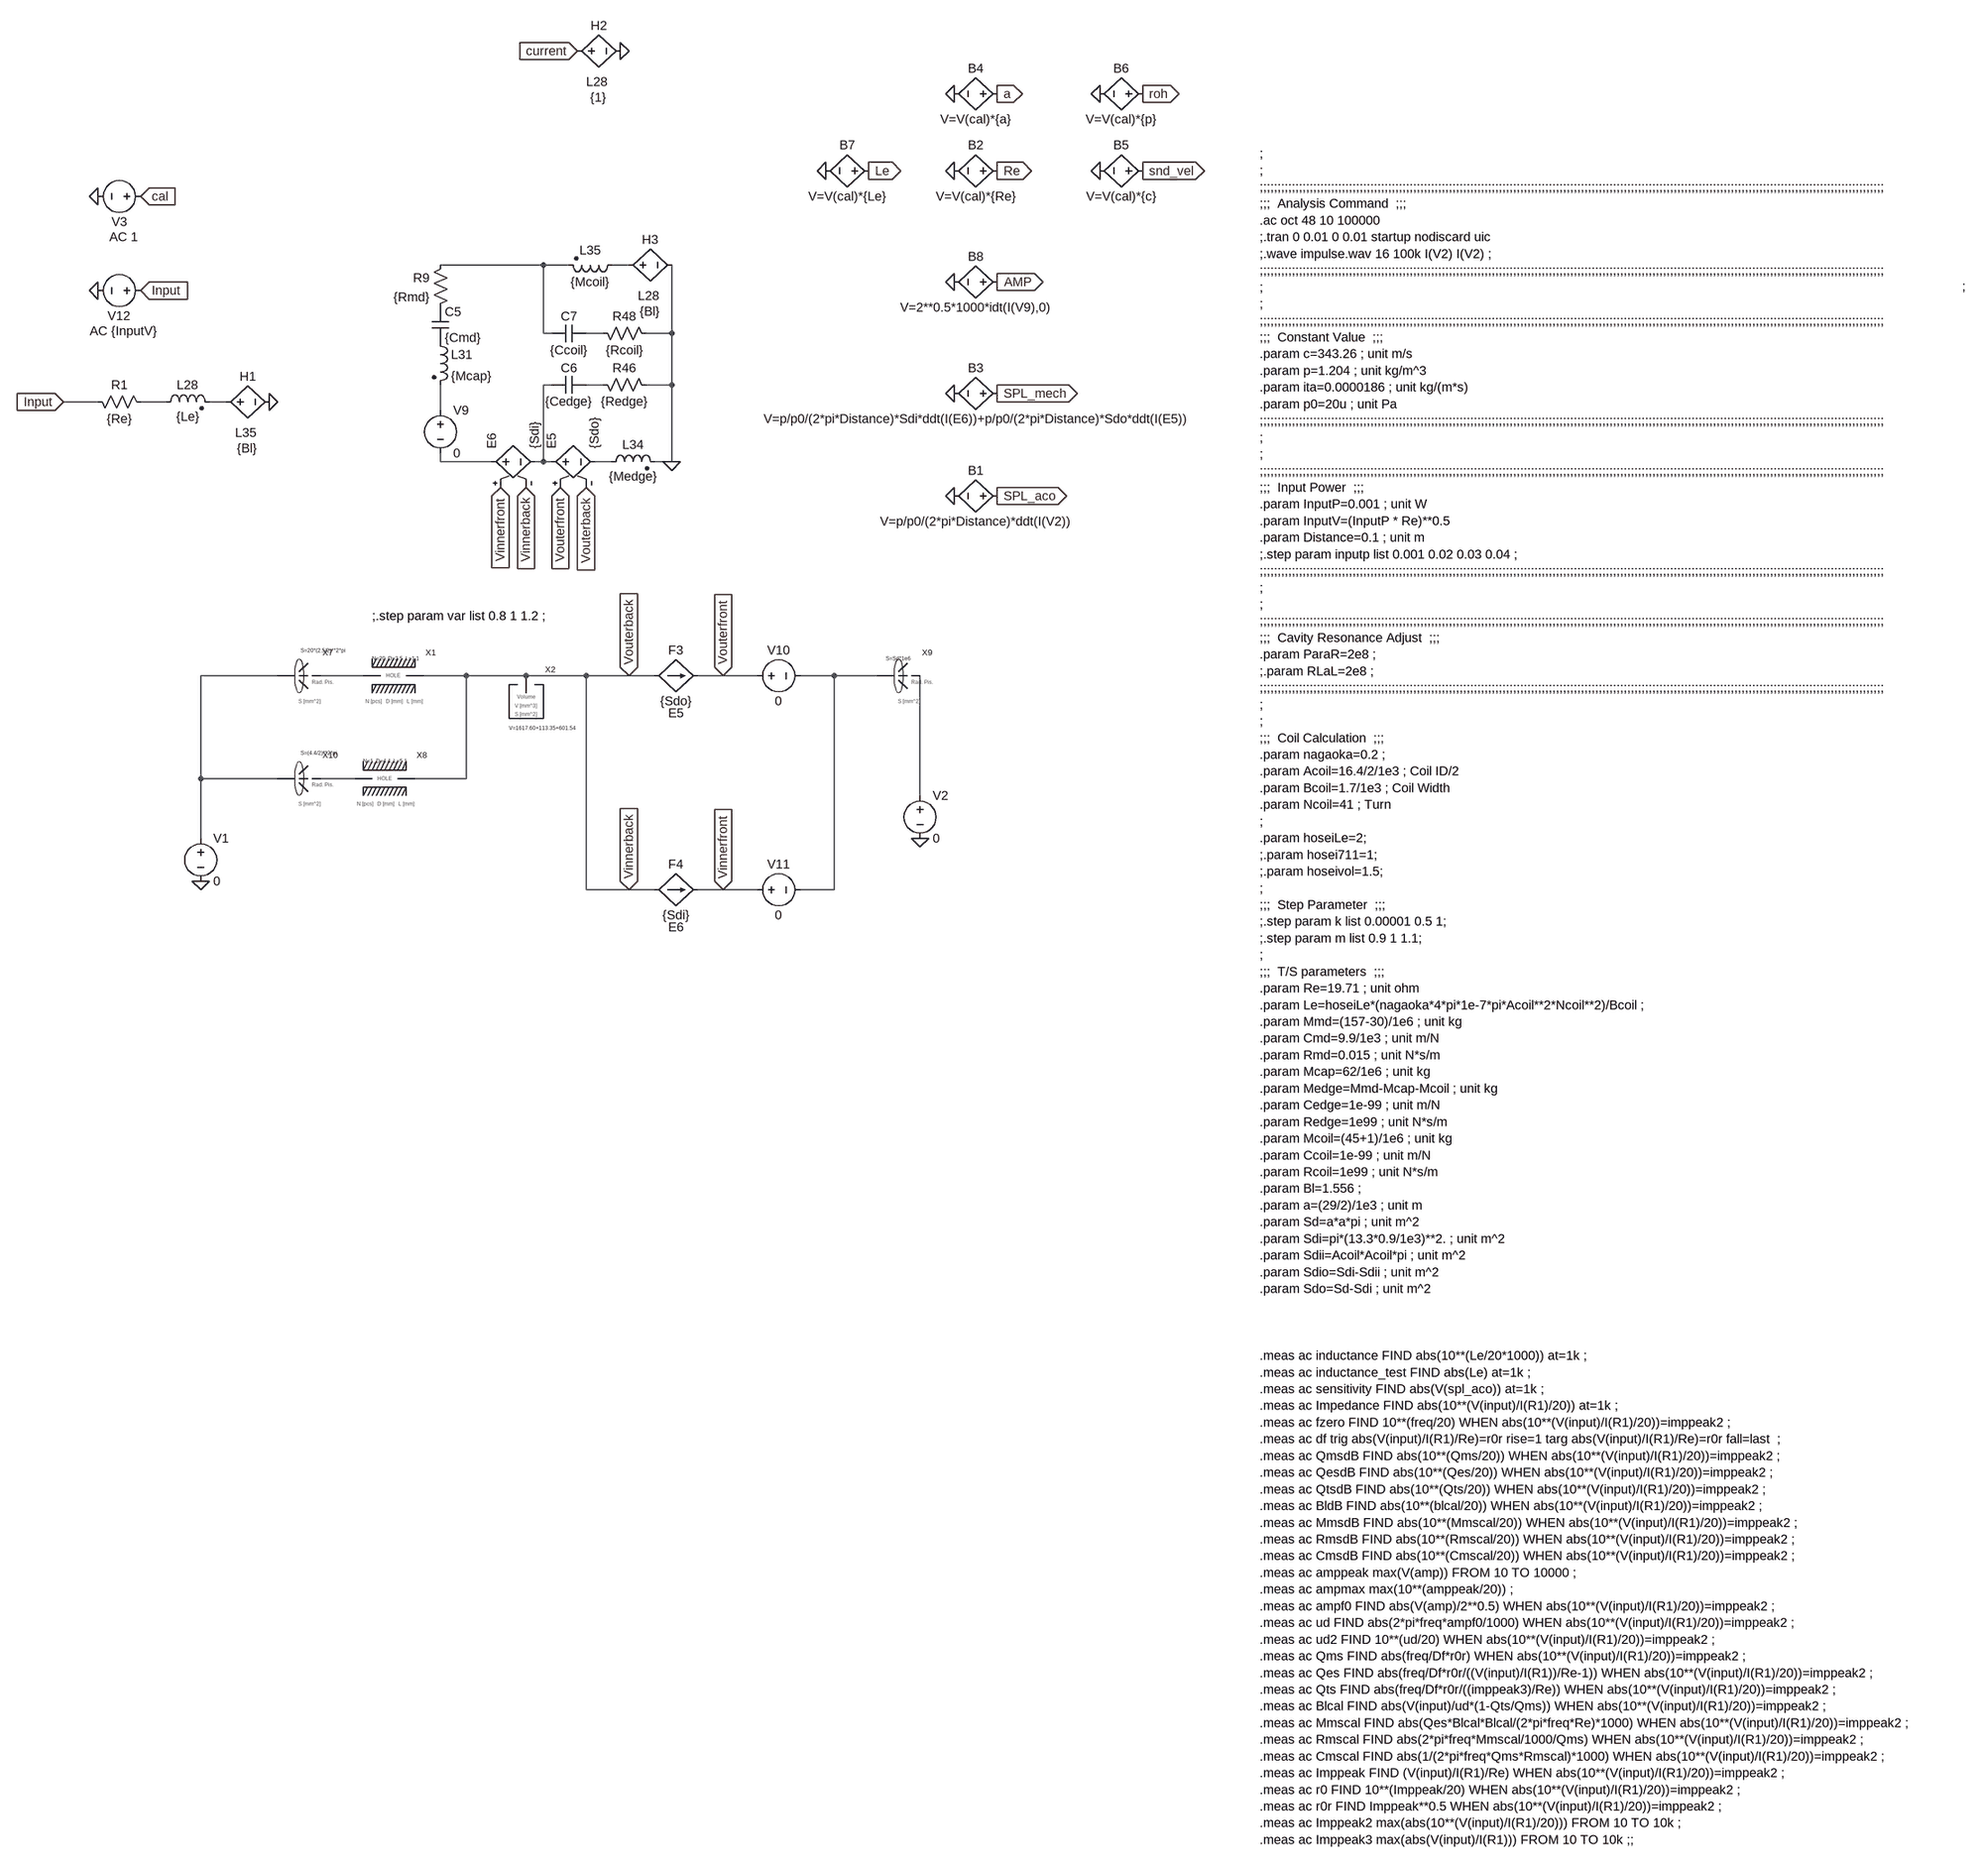
[diagram p0: schematic demo_08_test.asc]
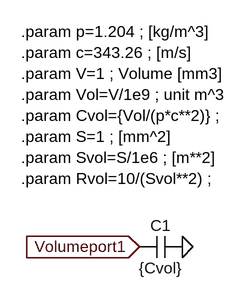
[diagram p1: sub-circuit volumemodel.asc]
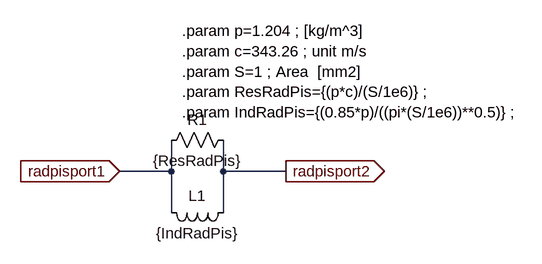
[diagram p2: sub-circuit radpismodel.asc]
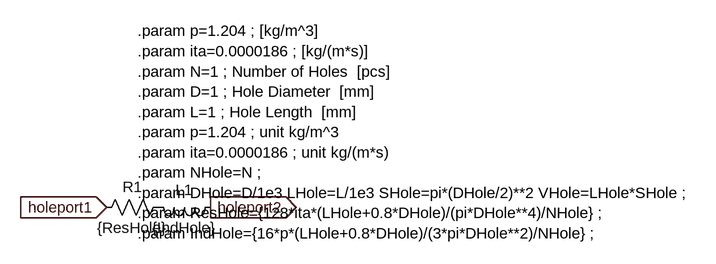
[diagram p3: sub-circuit holemodel.asc]
demo_08_test.asc, the LTspice schematic file:
Version 4
SHEET 1 6896 9720
WIRE -2464 -1328 -2656 -1328
WIRE -2416 -1328 -2464 -1328
WIRE -2304 -1328 -2336 -1328
WIRE -2464 -1200 -2464 -1328
WIRE -2448 -1200 -2464 -1200
WIRE -2352 -1200 -2384 -1200
WIRE -2224 -1200 -2224 -1328
WIRE -2224 -1200 -2272 -1200
WIRE -2448 -1104 -2464 -1104
WIRE -2352 -1104 -2384 -1104
WIRE -2224 -1104 -2224 -1200
WIRE -2224 -1104 -2272 -1104
WIRE -3296 -1072 -3360 -1072
WIRE -3168 -1072 -3216 -1072
WIRE -3056 -1072 -3088 -1072
WIRE -2656 -1056 -2656 -1104
WIRE -2656 -960 -2656 -976
WIRE -2560 -960 -2656 -960
WIRE -2464 -960 -2464 -1104
WIRE -2464 -960 -2480 -960
WIRE -2448 -960 -2464 -960
WIRE -2336 -960 -2368 -960
WIRE -2224 -960 -2224 -1104
WIRE -2224 -960 -2256 -960
WIRE -2960 -560 -3104 -560
WIRE -2800 -560 -2880 -560
WIRE -2608 -560 -2688 -560
WIRE -2496 -560 -2608 -560
WIRE -2384 -560 -2496 -560
WIRE -2304 -560 -2384 -560
WIRE -2256 -560 -2304 -560
WIRE -2128 -560 -2176 -560
WIRE -2064 -560 -2128 -560
WIRE -1920 -560 -1984 -560
WIRE -1840 -560 -1920 -560
WIRE -3104 -368 -3104 -560
WIRE -2960 -368 -3104 -368
WIRE -2816 -368 -2880 -368
WIRE -2608 -368 -2608 -560
WIRE -2608 -368 -2704 -368
WIRE -1760 -336 -1760 -560
WIRE -3104 -256 -3104 -368
WIRE -2384 -160 -2384 -560
WIRE -2304 -160 -2384 -160
WIRE -2256 -160 -2304 -160
WIRE -2128 -160 -2176 -160
WIRE -2064 -160 -2128 -160
WIRE -1920 -160 -1920 -560
WIRE -1920 -160 -1984 -160
FLAG -2976 -1072 0
FLAG -3360 -1072 Input
IOPIN -3360 -1072 In
FLAG -2224 -960 0
FLAG -2432 -912 Vouterfront
IOPIN -2432 -912 In
FLAG -2544 -912 Vinnerfront
IOPIN -2544 -912 In
FLAG -2496 -912 Vinnerback
IOPIN -2496 -912 In
FLAG -2384 -912 Vouterback
IOPIN -2384 -912 In
FLAG -3104 -176 0
FLAG -2304 -560 Vouterback
IOPIN -2304 -560 In
FLAG -2304 -160 Vinnerback
IOPIN -2304 -160 In
FLAG -2128 -560 Vouterfront
IOPIN -2128 -560 In
FLAG -2128 -160 Vinnerfront
IOPIN -2128 -160 In
FLAG -1616 -1088 SPL_mech
IOPIN -1616 -1088 Out
FLAG -1696 -1088 0
FLAG -3296 -1280 0
FLAG -1616 -1296 AMP
IOPIN -1616 -1296 Out
FLAG -1696 -1296 0
FLAG -1616 -896 SPL_aco
IOPIN -1616 -896 Out
FLAG -1696 -896 0
FLAG -3216 -1280 Input
IOPIN -3216 -1280 In
FLAG -1760 -256 0
FLAG -1616 -1504 Re
IOPIN -1616 -1504 Out
FLAG -1696 -1504 0
FLAG -3296 -1456 0
FLAG -3216 -1456 cal
IOPIN -3216 -1456 In
FLAG -2400 -1728 current
IOPIN -2400 -1728 In
FLAG -2320 -1728 0
FLAG -1616 -1648 a
IOPIN -1616 -1648 Out
FLAG -1696 -1648 0
FLAG -1344 -1504 snd_vel
IOPIN -1344 -1504 Out
FLAG -1424 -1504 0
FLAG -1344 -1648 roh
IOPIN -1344 -1648 Out
FLAG -1424 -1648 0
FLAG -1856 -1504 Le
IOPIN -1856 -1504 Out
FLAG -1936 -1504 0
SYMBOL res -3312 -1088 M90
WINDOW 0 0 56 VBottom 2
WINDOW 3 32 56 VTop 2
SYMATTR InstName R1
SYMATTR Value {Re}
SYMBOL ind2 -3184 -1056 R270
WINDOW 0 32 56 VTop 2
WINDOW 3 4 56 VBottom 2
SYMATTR InstName L28
SYMATTR Value {Le}
SYMATTR Type ind
SYMBOL res -2640 -1344 M0
SYMATTR InstName R9
SYMATTR Value {Rmd}
SYMBOL cap -2672 -1248 R0
SYMATTR InstName C5
SYMATTR Value {Cmd}
SYMBOL h -2320 -1328 R270
WINDOW 0 32 56 VTop 2
WINDOW 3 -71 55 VBottom 2
WINDOW 38 -42 53 VBottom 2
SYMATTR InstName H3
SYMATTR Value {Bl}
SYMATTR SpiceModel L28
SYMBOL ind2 -2672 -1200 R0
SYMATTR InstName L31
SYMATTR Value {Mcap}
SYMBOL voltage -2656 -1072 R0
SYMATTR InstName V9
SYMATTR Value 0
SYMBOL e -2464 -960 R270
SYMATTR InstName E5
SYMATTR Value {Sdo}
SYMBOL e -2576 -960 R270
SYMATTR InstName E6
SYMATTR Value {Sdi}
SYMBOL res -2368 -1120 M90
WINDOW 0 0 56 VBottom 2
WINDOW 3 32 56 VTop 2
SYMATTR InstName R46
SYMATTR Value {Redge}
SYMBOL cap -2448 -1088 R270
WINDOW 0 32 32 VTop 2
WINDOW 3 0 32 VBottom 2
SYMATTR InstName C6
SYMATTR Value {Cedge}
SYMBOL ind2 -2352 -944 R270
WINDOW 0 32 56 VTop 2
WINDOW 3 4 56 VBottom 2
SYMATTR InstName L34
SYMATTR Value {Medge}
SYMBOL ind2 -2320 -1344 R90
WINDOW 0 4 56 VBottom 2
WINDOW 3 32 56 VTop 2
SYMATTR InstName L35
SYMATTR Value {Mcoil}
SYMBOL res -2368 -1216 M90
WINDOW 0 0 56 VBottom 2
WINDOW 3 32 56 VTop 2
SYMATTR InstName R48
SYMATTR Value {Rcoil}
SYMBOL cap -2448 -1184 R270
WINDOW 0 32 32 VTop 2
WINDOW 3 0 32 VBottom 2
SYMATTR InstName C7
SYMATTR Value {Ccoil}
SYMBOL f -2256 -560 R270
WINDOW 0 32 40 VTop 2
WINDOW 3 -32 40 VBottom 2
WINDOW 38 -54 40 VBottom 2
SYMATTR InstName F3
SYMATTR Value {Sdo}
SYMATTR SpiceModel E5
SYMBOL voltage -2080 -560 R270
WINDOW 0 32 56 VTop 2
WINDOW 3 -32 56 VBottom 2
SYMATTR InstName V10
SYMATTR Value 0
SYMBOL voltage -2080 -160 R270
WINDOW 0 32 56 VTop 2
WINDOW 3 -32 56 VBottom 2
SYMATTR InstName V11
SYMATTR Value 0
SYMBOL f -2256 -160 R270
WINDOW 0 32 40 VTop 2
WINDOW 3 -32 40 VBottom 2
WINDOW 38 -54 40 VBottom 2
SYMATTR InstName F4
SYMATTR Value {Sdi}
SYMATTR SpiceModel E6
SYMBOL bv -1600 -1088 R90
WINDOW 0 -32 56 VBottom 2
WINDOW 3 32 56 VTop 2
SYMATTR InstName B3
SYMATTR Value V=p/p0/(2*pi*Distance)*Sdi*ddt(I(E6))+p/p0/(2*pi*Distance)*Sdo*ddt(I(E5))
SYMBOL voltage -3200 -1280 R90
WINDOW 0 32 56 VTop 2
WINDOW 3 -32 56 VBottom 2
WINDOW 123 60 48 VTop 2
WINDOW 39 0 0 Left 0
SYMATTR InstName V12
SYMATTR Value ""
SYMATTR Value2 AC {InputV}
SYMBOL bv -1600 -1296 R90
WINDOW 0 -32 56 VBottom 2
WINDOW 3 32 56 VTop 2
SYMATTR InstName B8
SYMATTR Value V=2**0.5*1000*idt(I(V9),0)
SYMBOL h -3072 -1072 R270
WINDOW 0 32 56 VTop 2
WINDOW 3 -71 55 VBottom 2
WINDOW 38 -42 53 VBottom 2
SYMATTR InstName H1
SYMATTR Value {Bl}
SYMATTR SpiceModel L35
SYMBOL bv -1600 -896 R90
WINDOW 0 -32 56 VBottom 2
WINDOW 3 32 56 VTop 2
SYMATTR InstName B1
SYMATTR Value V=p/p0/(2*pi*Distance)*ddt(I(V2))
SYMBOL My_symbol\\VolumeModel -2496 -560 R0
WINDOW 39 -32 98 Left 0
SYMATTR SpiceLine V=1617.60+113.35+601.54
SYMATTR InstName X2
SYMBOL My_symbol\\RadPisModel -2944 -592 R0
WINDOW 39 27 -15 Left 0
SYMATTR SpiceLine S=20*(2.5/2)**2*pi
SYMATTR InstName X7
SYMBOL My_symbol\\RadPisModel -1824 -592 R0
WINDOW 39 0 0 Left 0
SYMATTR SpiceLine S=Sd*1e6
SYMATTR InstName X9
SYMBOL voltage -3104 -272 R0
SYMATTR InstName V1
SYMATTR Value 0
SYMBOL voltage -1760 -352 R0
SYMATTR InstName V2
SYMATTR Value 0
SYMBOL bv -1600 -1504 R90
WINDOW 0 -32 56 VBottom 2
WINDOW 3 32 56 VTop 2
SYMATTR InstName B2
SYMATTR Value V=V(cal)*{Re}
SYMBOL voltage -3200 -1456 R90
WINDOW 0 32 56 VTop 2
WINDOW 3 -32 56 VBottom 2
WINDOW 123 60 48 VTop 2
WINDOW 39 0 0 Left 0
SYMATTR InstName V3
SYMATTR Value ""
SYMATTR Value2 AC 1
SYMBOL h -2416 -1728 R270
WINDOW 0 32 56 VTop 2
WINDOW 3 -71 55 VBottom 2
WINDOW 38 -42 53 VBottom 2
SYMATTR InstName H2
SYMATTR Value {1}
SYMATTR SpiceModel L28
SYMBOL bv -1600 -1648 R90
WINDOW 0 -32 56 VBottom 2
WINDOW 3 32 56 VTop 2
SYMATTR InstName B4
SYMATTR Value V=V(cal)*{a}
SYMBOL bv -1328 -1504 R90
WINDOW 0 -32 56 VBottom 2
WINDOW 3 32 56 VTop 2
SYMATTR InstName B5
SYMATTR Value V=V(cal)*{c}
SYMBOL bv -1328 -1648 R90
WINDOW 0 -32 56 VBottom 2
WINDOW 3 32 56 VTop 2
SYMATTR InstName B6
SYMATTR Value V=V(cal)*{p}
SYMBOL bv -1840 -1504 R90
WINDOW 0 -32 56 VBottom 2
WINDOW 3 32 56 VTop 2
SYMATTR InstName B7
SYMATTR Value V=V(cal)*{Le}
SYMBOL My_symbol\\HoleModel -2784 -592 R0
WINDOW 39 0 0 Left 0
SYMATTR InstName X1
SYMATTR SpiceLine N=20, D=2.5, L=1.1
SYMBOL My_symbol\\HoleModel -2800 -400 R0
WINDOW 39 0 0 Left 0
SYMATTR InstName X8
SYMATTR SpiceLine N=1, D=4.4, L=5.1
SYMBOL My_symbol\\RadPisModel -2944 -400 R0
WINDOW 39 27 -15 Left 0
SYMATTR SpiceLine S=(4.4/2)**2*pi
SYMATTR InstName X10
TEXT -992 -1536 Left 2 !;\n;\n;;;;;;;;;;;;;;;;;;;;;;;;;;;;;;;;;;;;;;;;;;;;;;;;;;;;;;;;;;;;;;;;;;;;;;;;;;;;;;;;;;;;;;;;;;;;;;;;;;;;;;;;;;;;;;;;;;;;;;;;;;;;;;;;;;;;;;;;;;;;;;;;;;;;;;;;;;;;;;;;;;;;;;;;;;;;;;;\n;;;  Analysis Command  ;;;\n.ac oct 48 10 100000\n;.tran 0 0.01 0 0.01 startup nodiscard uic\n;.wave impulse.wav 16 100k I(V2) I(V2) ;\n;;;;;;;;;;;;;;;;;;;;;;;;;;;;;;;;;;;;;;;;;;;;;;;;;;;;;;;;;;;;;;;;;;;;;;;;;;;;;;;;;;;;;;;;;;;;;;;;;;;;;;;;;;;;;;;;;;;;;;;;;;;;;;;;;;;;;;;;;;;;;;;;;;;;;;;;;;;;;;;;;;;;;;;;;;;;;;;\n;\n;\n;;;;;;;;;;;;;;;;;;;;;;;;;;;;;;;;;;;;;;;;;;;;;;;;;;;;;;;;;;;;;;;;;;;;;;;;;;;;;;;;;;;;;;;;;;;;;;;;;;;;;;;;;;;;;;;;;;;;;;;;;;;;;;;;;;;;;;;;;;;;;;;;;;;;;;;;;;;;;;;;;;;;;;;;;;;;;;;\n;;;  Constant Value  ;;;\n.param c=343.26 ; unit m/s\n.param p=1.204 ; unit kg/m^3\n.param ita=0.0000186 ; unit kg/(m*s)\n.param p0=20u ; unit Pa\n;;;;;;;;;;;;;;;;;;;;;;;;;;;;;;;;;;;;;;;;;;;;;;;;;;;;;;;;;;;;;;;;;;;;;;;;;;;;;;;;;;;;;;;;;;;;;;;;;;;;;;;;;;;;;;;;;;;;;;;;;;;;;;;;;;;;;;;;;;;;;;;;;;;;;;;;;;;;;;;;;;;;;;;;;;;;;;;\n;\n;\n;;;;;;;;;;;;;;;;;;;;;;;;;;;;;;;;;;;;;;;;;;;;;;;;;;;;;;;;;;;;;;;;;;;;;;;;;;;;;;;;;;;;;;;;;;;;;;;;;;;;;;;;;;;;;;;;;;;;;;;;;;;;;;;;;;;;;;;;;;;;;;;;;;;;;;;;;;;;;;;;;;;;;;;;;;;;;;;\n;;;  Input Power  ;;;\n.param InputP=0.001 ; unit W\n.param InputV=(InputP * Re)**0.5\n.param Distance=0.1 ; unit m\n;.step param inputp list 0.001 0.02 0.03 0.04 ;\n;;;;;;;;;;;;;;;;;;;;;;;;;;;;;;;;;;;;;;;;;;;;;;;;;;;;;;;;;;;;;;;;;;;;;;;;;;;;;;;;;;;;;;;;;;;;;;;;;;;;;;;;;;;;;;;;;;;;;;;;;;;;;;;;;;;;;;;;;;;;;;;;;;;;;;;;;;;;;;;;;;;;;;;;;;;;;;;\n;\n;\n;;;;;;;;;;;;;;;;;;;;;;;;;;;;;;;;;;;;;;;;;;;;;;;;;;;;;;;;;;;;;;;;;;;;;;;;;;;;;;;;;;;;;;;;;;;;;;;;;;;;;;;;;;;;;;;;;;;;;;;;;;;;;;;;;;;;;;;;;;;;;;;;;;;;;;;;;;;;;;;;;;;;;;;;;;;;;;;\n;;;  Cavity Resonance Adjust  ;;;\n.param ParaR=2e8 ;\n;.param RLaL=2e8 ;\n;;;;;;;;;;;;;;;;;;;;;;;;;;;;;;;;;;;;;;;;;;;;;;;;;;;;;;;;;;;;;;;;;;;;;;;;;;;;;;;;;;;;;;;;;;;;;;;;;;;;;;;;;;;;;;;;;;;;;;;;;;;;;;;;;;;;;;;;;;;;;;;;;;;;;;;;;;;;;;;;;;;;;;;;;;;;;;;\n;\n;\n;;;  Coil Calculation  ;;;\n.param nagaoka=0.2 ; \n.param Acoil=16.4/2/1e3 ; Coil ID/2\n.param Bcoil=1.7/1e3 ; Coil Width\n.param Ncoil=41 ; Turn\n;\n.param hoseiLe=2;\n;.param hosei711=1;\n;.param hoseivol=1.5;\n;\n;;;  Step Parameter  ;;;\n;.step param k list 0.00001 0.5 1;\n;.step param m list 0.9 1 1.1;\n;\n;;;  T/S parameters  ;;;\n.param Re=19.71 ; unit ohm\n.param Le=hoseiLe*(nagaoka*4*pi*1e-7*pi*Acoil**2*Ncoil**2)/Bcoil ; \n.param Mmd=(157-30)/1e6 ; unit kg\n.param Cmd=9.9/1e3 ; unit m/N\n.param Rmd=0.015 ; unit N*s/m\n.param Mcap=62/1e6 ; unit kg\n.param Medge=Mmd-Mcap-Mcoil ; unit kg\n.param Cedge=1e-99 ; unit m/N\n.param Redge=1e99 ; unit N*s/m\n.param Mcoil=(45+1)/1e6 ; unit kg\n.param Ccoil=1e-99 ; unit m/N\n.param Rcoil=1e99 ; unit N*s/m\n.param Bl=1.556 ;\n.param a=(29/2)/1e3 ; unit m\n.param Sd=a*a*pi ; unit m^2\n.param Sdi=pi*(13.3*0.9/1e3)**2. ; unit m^2 \n.param Sdii=Acoil*Acoil*pi ; unit m^2 \n.param Sdio=Sdi-Sdii ; unit m^2 \n.param Sdo=Sd-Sdi ; unit m^2\n \n \n \n \n \n \n.meas ac inductance FIND abs(10**(Le/20*1000)) at=1k ;\n.meas ac inductance_test FIND abs(Le) at=1k ;\n.meas ac sensitivity FIND abs(V(spl_aco)) at=1k ;\n.meas ac Impedance FIND abs(10**(V(input)/I(R1)/20)) at=1k ;\n.meas ac fzero FIND 10**(freq/20) WHEN abs(10**(V(input)/I(R1)/20))=imppeak2 ;\n.meas ac df trig abs(V(input)/I(R1)/Re)=r0r rise=1 targ abs(V(input)/I(R1)/Re)=r0r fall=last  ;\n.meas ac QmsdB FIND abs(10**(Qms/20)) WHEN abs(10**(V(input)/I(R1)/20))=imppeak2 ; \n.meas ac QesdB FIND abs(10**(Qes/20)) WHEN abs(10**(V(input)/I(R1)/20))=imppeak2 ; \n.meas ac QtsdB FIND abs(10**(Qts/20)) WHEN abs(10**(V(input)/I(R1)/20))=imppeak2 ; \n.meas ac BldB FIND abs(10**(blcal/20)) WHEN abs(10**(V(input)/I(R1)/20))=imppeak2 ; \n.meas ac MmsdB FIND abs(10**(Mmscal/20)) WHEN abs(10**(V(input)/I(R1)/20))=imppeak2 ; \n.meas ac RmsdB FIND abs(10**(Rmscal/20)) WHEN abs(10**(V(input)/I(R1)/20))=imppeak2 ; \n.meas ac CmsdB FIND abs(10**(Cmscal/20)) WHEN abs(10**(V(input)/I(R1)/20))=imppeak2 ; \n.meas ac amppeak max(V(amp)) FROM 10 TO 10000 ;\n.meas ac ampmax max(10**(amppeak/20)) ;\n.meas ac ampf0 FIND abs(V(amp)/2**0.5) WHEN abs(10**(V(input)/I(R1)/20))=imppeak2 ; \n.meas ac ud FIND abs(2*pi*freq*ampf0/1000) WHEN abs(10**(V(input)/I(R1)/20))=imppeak2 ; \n.meas ac ud2 FIND 10**(ud/20) WHEN abs(10**(V(input)/I(R1)/20))=imppeak2 ; \n.meas ac Qms FIND abs(freq/Df*r0r) WHEN abs(10**(V(input)/I(R1)/20))=imppeak2 ; \n.meas ac Qes FIND abs(freq/Df*r0r/((V(input)/I(R1))/Re-1)) WHEN abs(10**(V(input)/I(R1)/20))=imppeak2 ; \n.meas ac Qts FIND abs(freq/Df*r0r/((imppeak3)/Re)) WHEN abs(10**(V(input)/I(R1)/20))=imppeak2 ; \n.meas ac Blcal FIND abs(V(input)/ud*(1-Qts/Qms)) WHEN abs(10**(V(input)/I(R1)/20))=imppeak2 ; \n.meas ac Mmscal FIND abs(Qes*Blcal*Blcal/(2*pi*freq*Re)*1000) WHEN abs(10**(V(input)/I(R1)/20))=imppeak2 ; \n.meas ac Rmscal FIND abs(2*pi*freq*Mmscal/1000/Qms) WHEN abs(10**(V(input)/I(R1)/20))=imppeak2 ; \n.meas ac Cmscal FIND abs(1/(2*pi*freq*Qms*Rmscal)*1000) WHEN abs(10**(V(input)/I(R1)/20))=imppeak2 ; \n.meas ac Imppeak FIND (V(input)/I(R1)/Re) WHEN abs(10**(V(input)/I(R1)/20))=imppeak2 ;\n.meas ac r0 FIND 10**(Imppeak/20) WHEN abs(10**(V(input)/I(R1)/20))=imppeak2 ;\n.meas ac r0r FIND Imppeak**0.5 WHEN abs(10**(V(input)/I(R1)/20))=imppeak2 ;\n.meas ac Imppeak2 max(abs(10**(V(input)/I(R1)/20))) FROM 10 TO 10k ;\n.meas ac Imppeak3 max(abs(V(input)/I(R1))) FROM 10 TO 10k ;;
TEXT 2064 -1288 Left 2 !;
TEXT -2784 -672 Left 2 !;.step param var list 0.8 1 1.2 ;

volumemodel.asc, the sub-circuit schematic file:
Version 4
SHEET 1 1216 680
FLAG 384 480 Volumeport1
IOPIN 384 480 In
FLAG 448 480 0
SYMBOL cap 448 464 R90
WINDOW 0 0 32 VBottom 2
WINDOW 3 32 32 VTop 2
SYMATTR InstName C1
SYMATTR Value {Cvol}
SYMATTR SpiceLine Rpar={Rvol}
TEXT 208 160 Left 2 !.param p=1.204 ; [kg/m^3]\n.param c=343.26 ; [m/s]\n.param V=1 ; Volume [mm3]\n.param Vol=V/1e9 ; unit m^3\n.param Cvol={Vol/(p*c**2)} ;\n.param S=1 ; [mm^2]\n.param Svol=S/1e6 ; [m**2]\n.param Rvol=10/(Svol**2) ;

radpismodel.asc, the sub-circuit schematic file:
Version 4
SHEET 1 1216 680
WIRE 192 480 192 432
WIRE 192 480 112 480
WIRE 272 480 272 432
WIRE 368 480 272 480
WIRE 192 544 192 480
WIRE 272 544 272 480
FLAG 112 480 radpisport1
IOPIN 112 480 In
FLAG 368 480 radpisport2
IOPIN 368 480 Out
SYMBOL res 288 416 R90
WINDOW 0 0 56 VBottom 2
WINDOW 3 32 56 VTop 2
SYMATTR InstName R1
SYMATTR Value {ResRadPis}
SYMBOL ind 288 528 R90
WINDOW 0 5 56 VBottom 2
WINDOW 3 32 56 VTop 2
SYMATTR InstName L1
SYMATTR Value {IndRadPis}
TEXT 208 264 Left 2 !.param p=1.204 ; [kg/m^3]\n.param c=343.26 ; unit m/s\n.param S=1 ; Area  [mm2]\n.param ResRadPis={(p*c)/(S/1e6)} ;\n.param IndRadPis={(0.85*p)/((pi*(S/1e6))**0.5)} ;

holemodel.asc, the sub-circuit schematic file:
Version 4
SHEET 1 1216 680
FLAG 160 432 holeport1
IOPIN 160 432 In
FLAG 320 432 holeport2
IOPIN 320 432 Out
SYMBOL res 256 416 R90
WINDOW 0 0 56 VBottom 2
WINDOW 3 32 56 VTop 2
SYMATTR InstName R1
SYMATTR Value {ResHole}
SYMBOL ind 336 416 R90
WINDOW 0 5 56 VBottom 2
WINDOW 3 32 56 VTop 2
SYMATTR InstName L1
SYMATTR Value {IndHole}
TEXT 208 160 Left 2 !.param p=1.204 ; [kg/m^3]\n.param ita=0.0000186 ; [kg/(m*s)]\n.param N=1 ; Number of Holes  [pcs]\n.param D=1 ; Hole Diameter  [mm]\n.param L=1 ; Hole Length  [mm]\n.param p=1.204 ; unit kg/m^3\n.param ita=0.0000186 ; unit kg/(m*s)\n.param NHole=N ;\n.param DHole=D/1e3 LHole=L/1e3 SHole=pi*(DHole/2)**2 VHole=LHole*SHole ;\n.param ResHole={128*ita*(LHole+0.8*DHole)/(pi*DHole**4)/NHole} ;\n.param IndHole={16*p*(LHole+0.8*DHole)/(3*pi*DHole**2)/NHole} ;

The netlist it stands for:
* demo_08_test.asc
R1 Input N006 {Re}
L28 N006 N007 {Le}
R9 N001 P001 {Rmd}
C5 P001 P002 {Cmd}
H3 N002 0 L28 {Bl}
L31 P002 N008 {Mcap}
V9 N008 N009 0
E5 N004 N010 Vouterfront Vouterback {Sdo}
E6 N009 N004 Vinnerfront Vouterback {Sdi}
R46 N005 0 {Redge}
C6 N004 N005 {Cedge}
L34 N010 0 {Medge}
L35 N002 N001 {Mcoil}
R48 N003 0 {Rcoil}
C7 N001 N003 {Ccoil}
F3 Vouterback Vouterfront E5 {Sdo}
V10 Vouterfront N013 0
V11 Vinnerfront N013 0
F4 Vouterback Vinnerfront E6 {Sdi}
B3 SPL_mech 0 V=p/p0/(2*pi*Distance)*Sdi*ddt(I(E6))+p/p0/(2*pi*Distance)*Sdo*ddt(I(E5))
V12 Input 0 AC {InputV}
B8 AMP 0 V=2**0.5*1000*idt(I(V9),0)
H1 N007 0 L35 {Bl}
B1 SPL_aco 0 V=p/p0/(2*pi*Distance)*ddt(I(V2))
XX2 Vouterback volumemodel params: V=1617.60+113.35+601.54
XX7 N011 N012 radpismodel params: S=20*(2.5/2)**2*pi
XX9 N013 N015 radpismodel params: S=Sd*1e6
V1 N011 0 0
V2 N015 0 0
B2 Re 0 V=V(cal)*{Re}
V3 cal 0 AC 1
H2 current 0 L28 {1}
B4 a 0 V=V(cal)*{a}
B5 snd_vel 0 V=V(cal)*{c}
B6 roh 0 V=V(cal)*{p}
B7 Le 0 V=V(cal)*{Le}
XX1 N012 Vouterback holemodel params: N=20, D=2.5, L=1.1
XX8 N014 Vouterback holemodel params: N=1, D=4.4, L=5.1
XX10 N011 N014 radpismodel params: S=(4.4/2)**2*pi

* block symbol definitions
.subckt volumemodel Volumeport1
C1 0 Volumeport1 {Cvol} Rpar={Rvol}
.param p=1.204 ; [kg/m^3]
.param c=343.26 ; [m/s]
.param V=1 ; Volume [mm3]
.param Vol=V/1e9 ; unit m^3
.param Cvol={Vol/(p*c**2)} ;
.param S=1 ; [mm^2]
.param Svol=S/1e6 ; [m**2]
.param Rvol=10/(Svol**2) ;
.ends volumemodel

.subckt radpismodel radpisport1 radpisport2
R1 radpisport2 radpisport1 {ResRadPis}
L1 radpisport2 radpisport1 {IndRadPis}
.param p=1.204 ; [kg/m^3]
.param c=343.26 ; unit m/s
.param S=1 ; Area  [mm2]
.param ResRadPis={(p*c)/(S/1e6)} ;
.param IndRadPis={(0.85*p)/((pi*(S/1e6))**0.5)} ;
.ends radpismodel

.subckt holemodel holeport1 holeport2
R1 P001 holeport1 {ResHole}
L1 holeport2 P001 {IndHole}
.param p=1.204 ; [kg/m^3]
.param ita=0.0000186 ; [kg/(m*s)]
.param N=1 ; Number of Holes  [pcs]
.param D=1 ; Hole Diameter  [mm]
.param L=1 ; Hole Length  [mm]
.param p=1.204 ; unit kg/m^3
.param ita=0.0000186 ; unit kg/(m*s)
.param NHole=N ;
.param DHole=D/1e3 LHole=L/1e3 SHole=pi*(DHole/2)**2 VHole=LHole*SHole ;
.param ResHole={128*ita*(LHole+0.8*DHole)/(pi*DHole**4)/NHole} ;
.param IndHole={16*p*(LHole+0.8*DHole)/(3*pi*DHole**2)/NHole} ;
.ends holemodel

;
;
;;;;;;;;;;;;;;;;;;;;;;;;;;;;;;;;;;;;;;;;;;;;;;;;;;;;;;;;;;;;;;;;;;;;;;;;;;;;;;;;;;;;;;;;;;;;;;;;;;;;;;;;;;;;;;;;;;;;;;;;;;;;;;;;;;;;;;;;;;;;;;;;;;;;;;;;;;;;;;;;;;;;;;;;;;;;;;;
;;;  Analysis Command  ;;;
.ac oct 48 10 100000
;.tran 0 0.01 0 0.01 startup nodiscard uic
;.wave impulse.wav 16 100k I(V2) I(V2) ;
;;;;;;;;;;;;;;;;;;;;;;;;;;;;;;;;;;;;;;;;;;;;;;;;;;;;;;;;;;;;;;;;;;;;;;;;;;;;;;;;;;;;;;;;;;;;;;;;;;;;;;;;;;;;;;;;;;;;;;;;;;;;;;;;;;;;;;;;;;;;;;;;;;;;;;;;;;;;;;;;;;;;;;;;;;;;;;;
;
;
;;;;;;;;;;;;;;;;;;;;;;;;;;;;;;;;;;;;;;;;;;;;;;;;;;;;;;;;;;;;;;;;;;;;;;;;;;;;;;;;;;;;;;;;;;;;;;;;;;;;;;;;;;;;;;;;;;;;;;;;;;;;;;;;;;;;;;;;;;;;;;;;;;;;;;;;;;;;;;;;;;;;;;;;;;;;;;;
;;;  Constant Value  ;;;
.param c=343.26 ; unit m/s
.param p=1.204 ; unit kg/m^3
.param ita=0.0000186 ; unit kg/(m*s)
.param p0=20u ; unit Pa
;;;;;;;;;;;;;;;;;;;;;;;;;;;;;;;;;;;;;;;;;;;;;;;;;;;;;;;;;;;;;;;;;;;;;;;;;;;;;;;;;;;;;;;;;;;;;;;;;;;;;;;;;;;;;;;;;;;;;;;;;;;;;;;;;;;;;;;;;;;;;;;;;;;;;;;;;;;;;;;;;;;;;;;;;;;;;;;
;
;
;;;;;;;;;;;;;;;;;;;;;;;;;;;;;;;;;;;;;;;;;;;;;;;;;;;;;;;;;;;;;;;;;;;;;;;;;;;;;;;;;;;;;;;;;;;;;;;;;;;;;;;;;;;;;;;;;;;;;;;;;;;;;;;;;;;;;;;;;;;;;;;;;;;;;;;;;;;;;;;;;;;;;;;;;;;;;;;
;;;  Input Power  ;;;
.param InputP=0.001 ; unit W
.param InputV=(InputP * Re)**0.5
.param Distance=0.1 ; unit m
;.step param inputp list 0.001 0.02 0.03 0.04 ;
;;;;;;;;;;;;;;;;;;;;;;;;;;;;;;;;;;;;;;;;;;;;;;;;;;;;;;;;;;;;;;;;;;;;;;;;;;;;;;;;;;;;;;;;;;;;;;;;;;;;;;;;;;;;;;;;;;;;;;;;;;;;;;;;;;;;;;;;;;;;;;;;;;;;;;;;;;;;;;;;;;;;;;;;;;;;;;;
;
;
;;;;;;;;;;;;;;;;;;;;;;;;;;;;;;;;;;;;;;;;;;;;;;;;;;;;;;;;;;;;;;;;;;;;;;;;;;;;;;;;;;;;;;;;;;;;;;;;;;;;;;;;;;;;;;;;;;;;;;;;;;;;;;;;;;;;;;;;;;;;;;;;;;;;;;;;;;;;;;;;;;;;;;;;;;;;;;;
;;;  Cavity Resonance Adjust  ;;;
.param ParaR=2e8 ;
;.param RLaL=2e8 ;
;;;;;;;;;;;;;;;;;;;;;;;;;;;;;;;;;;;;;;;;;;;;;;;;;;;;;;;;;;;;;;;;;;;;;;;;;;;;;;;;;;;;;;;;;;;;;;;;;;;;;;;;;;;;;;;;;;;;;;;;;;;;;;;;;;;;;;;;;;;;;;;;;;;;;;;;;;;;;;;;;;;;;;;;;;;;;;;
;
;
;;;  Coil Calculation  ;;;
.param nagaoka=0.2 ;
.param Acoil=16.4/2/1e3 ; Coil ID/2
.param Bcoil=1.7/1e3 ; Coil Width
.param Ncoil=41 ; Turn
;
.param hoseiLe=2;
;.param hosei711=1;
;.param hoseivol=1.5;
;
;;;  Step Parameter  ;;;
;.step param k list 0.00001 0.5 1;
;.step param m list 0.9 1 1.1;
;
;;;  T/S parameters  ;;;
.param Re=19.71 ; unit ohm
.param Le=hoseiLe*(nagaoka*4*pi*1e-7*pi*Acoil**2*Ncoil**2)/Bcoil ;
.param Mmd=(157-30)/1e6 ; unit kg
.param Cmd=9.9/1e3 ; unit m/N
.param Rmd=0.015 ; unit N*s/m
.param Mcap=62/1e6 ; unit kg
.param Medge=Mmd-Mcap-Mcoil ; unit kg
.param Cedge=1e-99 ; unit m/N
.param Redge=1e99 ; unit N*s/m
.param Mcoil=(45+1)/1e6 ; unit kg
.param Ccoil=1e-99 ; unit m/N
.param Rcoil=1e99 ; unit N*s/m
.param Bl=1.556 ;
.param a=(29/2)/1e3 ; unit m
.param Sd=a*a*pi ; unit m^2
.param Sdi=pi*(13.3*0.9/1e3)**2. ; unit m^2
.param Sdii=Acoil*Acoil*pi ; unit m^2
.param Sdio=Sdi-Sdii ; unit m^2
.param Sdo=Sd-Sdi ; unit m^2
.meas ac inductance FIND abs(10**(Le/20*1000)) at=1k ;
.meas ac inductance_test FIND abs(Le) at=1k ;
.meas ac sensitivity FIND abs(V(spl_aco)) at=1k ;
.meas ac Impedance FIND abs(10**(V(input)/I(R1)/20)) at=1k ;
.meas ac fzero FIND 10**(freq/20) WHEN abs(10**(V(input)/I(R1)/20))=imppeak2 ;
.meas ac df trig abs(V(input)/I(R1)/Re)=r0r rise=1 targ abs(V(input)/I(R1)/Re)=r0r fall=last  ;
.meas ac QmsdB FIND abs(10**(Qms/20)) WHEN abs(10**(V(input)/I(R1)/20))=imppeak2 ;
.meas ac QesdB FIND abs(10**(Qes/20)) WHEN abs(10**(V(input)/I(R1)/20))=imppeak2 ;
.meas ac QtsdB FIND abs(10**(Qts/20)) WHEN abs(10**(V(input)/I(R1)/20))=imppeak2 ;
.meas ac BldB FIND abs(10**(blcal/20)) WHEN abs(10**(V(input)/I(R1)/20))=imppeak2 ;
.meas ac MmsdB FIND abs(10**(Mmscal/20)) WHEN abs(10**(V(input)/I(R1)/20))=imppeak2 ;
.meas ac RmsdB FIND abs(10**(Rmscal/20)) WHEN abs(10**(V(input)/I(R1)/20))=imppeak2 ;
.meas ac CmsdB FIND abs(10**(Cmscal/20)) WHEN abs(10**(V(input)/I(R1)/20))=imppeak2 ;
.meas ac amppeak max(V(amp)) FROM 10 TO 10000 ;
.meas ac ampmax max(10**(amppeak/20)) ;
.meas ac ampf0 FIND abs(V(amp)/2**0.5) WHEN abs(10**(V(input)/I(R1)/20))=imppeak2 ;
.meas ac ud FIND abs(2*pi*freq*ampf0/1000) WHEN abs(10**(V(input)/I(R1)/20))=imppeak2 ;
.meas ac ud2 FIND 10**(ud/20) WHEN abs(10**(V(input)/I(R1)/20))=imppeak2 ;
.meas ac Qms FIND abs(freq/Df*r0r) WHEN abs(10**(V(input)/I(R1)/20))=imppeak2 ;
.meas ac Qes FIND abs(freq/Df*r0r/((V(input)/I(R1))/Re-1)) WHEN abs(10**(V(input)/I(R1)/20))=imppeak2 ;
.meas ac Qts FIND abs(freq/Df*r0r/((imppeak3)/Re)) WHEN abs(10**(V(input)/I(R1)/20))=imppeak2 ;
.meas ac Blcal FIND abs(V(input)/ud*(1-Qts/Qms)) WHEN abs(10**(V(input)/I(R1)/20))=imppeak2 ;
.meas ac Mmscal FIND abs(Qes*Blcal*Blcal/(2*pi*freq*Re)*1000) WHEN abs(10**(V(input)/I(R1)/20))=imppeak2 ;
.meas ac Rmscal FIND abs(2*pi*freq*Mmscal/1000/Qms) WHEN abs(10**(V(input)/I(R1)/20))=imppeak2 ;
.meas ac Cmscal FIND abs(1/(2*pi*freq*Qms*Rmscal)*1000) WHEN abs(10**(V(input)/I(R1)/20))=imppeak2 ;
.meas ac Imppeak FIND (V(input)/I(R1)/Re) WHEN abs(10**(V(input)/I(R1)/20))=imppeak2 ;
.meas ac r0 FIND 10**(Imppeak/20) WHEN abs(10**(V(input)/I(R1)/20))=imppeak2 ;
.meas ac r0r FIND Imppeak**0.5 WHEN abs(10**(V(input)/I(R1)/20))=imppeak2 ;
.meas ac Imppeak2 max(abs(10**(V(input)/I(R1)/20))) FROM 10 TO 10k ;
.meas ac Imppeak3 max(abs(V(input)/I(R1))) FROM 10 TO 10k ;;
;
;.step param var list 0.8 1 1.2 ;
.backanno
.end